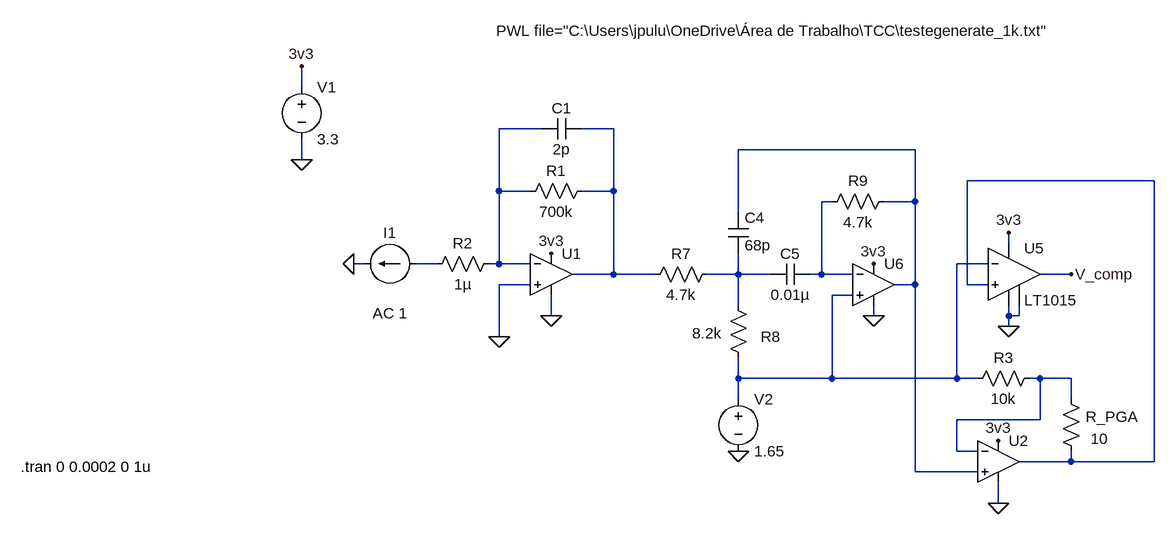
[diagram p0: schematic circuitBackup.asc]
circuitBackup.asc, the LTspice schematic file:
Version 4.1
SHEET 1 1912 1068
WIRE -368 -112 -368 -144
WIRE 0 -48 -64 -48
WIRE 112 -48 64 -48
WIRE 576 -16 304 -16
WIRE -368 0 -368 -32
WIRE 944 32 656 32
WIRE -64 48 -64 -48
WIRE -16 48 -64 48
WIRE 112 48 112 -48
WIRE 112 48 64 48
WIRE 448 64 432 64
WIRE 576 64 576 -16
WIRE 576 64 528 64
WIRE 304 80 304 -16
WIRE 720 128 720 112
WIRE -272 160 -288 160
WIRE -160 160 -192 160
WIRE -64 160 -64 48
WIRE -64 160 -80 160
WIRE -16 160 -64 160
WIRE 688 160 640 160
WIRE 112 176 112 48
WIRE 112 176 48 176
WIRE 176 176 112 176
WIRE 304 176 304 144
WIRE 304 176 256 176
WIRE 352 176 304 176
WIRE 432 176 432 64
WIRE 432 176 416 176
WIRE 480 176 432 176
WIRE 816 176 768 176
WIRE -16 192 -64 192
WIRE 576 192 576 64
WIRE 576 192 544 192
WIRE 656 192 656 32
WIRE 688 192 656 192
WIRE 480 208 448 208
WIRE 304 224 304 176
WIRE 16 240 16 208
WIRE 512 240 512 224
WIRE 720 240 720 224
WIRE 736 240 736 224
WIRE 736 240 720 240
WIRE 720 256 720 240
WIRE -64 272 -64 192
WIRE 304 336 304 304
WIRE 448 336 448 208
WIRE 448 336 304 336
WIRE 640 336 640 160
WIRE 640 336 448 336
WIRE 672 336 640 336
WIRE 768 336 752 336
WIRE 816 336 768 336
WIRE 304 368 304 336
WIRE 816 368 816 336
WIRE 768 400 768 336
WIRE 768 400 640 400
WIRE 640 448 640 400
WIRE 672 448 640 448
WIRE 816 464 816 448
WIRE 816 464 736 464
WIRE 944 464 944 32
WIRE 944 464 816 464
WIRE 576 480 576 192
WIRE 672 480 576 480
WIRE 704 528 704 496
FLAG 16 144 3v3
FLAG 16 240 0
FLAG -64 272 0
FLAG -288 160 0
FLAG 816 176 V_comp
FLAG 720 112 3v3
FLAG 720 256 0
FLAG 512 160 3v3
FLAG 512 240 0
FLAG 304 448 0
FLAG -368 0 0
FLAG -368 -144 3v3
FLAG 704 528 0
FLAG 704 432 3v3
SYMBOL res 80 32 R90
WINDOW 0 0 56 VBottom 2
WINDOW 3 32 56 VTop 2
SYMATTR InstName R1
SYMATTR Value 700k
SYMBOL cap 64 -64 R90
WINDOW 0 0 32 VBottom 2
WINDOW 3 32 32 VTop 2
SYMATTR InstName C1
SYMATTR Value 2p
SYMBOL res -64 144 R90
WINDOW 0 0 56 VBottom 2
WINDOW 3 32 56 VTop 2
SYMATTR InstName R2
SYMATTR Value 1µ
SYMBOL current -192 160 R90
WINDOW 0 -32 40 VBottom 2
WINDOW 3 -374 -552 VTop 2
WINDOW 123 60 40 VTop 2
WINDOW 39 0 0 Left 0
SYMATTR InstName I1
SYMATTR Value PWL file="C:\Users\jpulu\OneDrive\Área de Trabalho\TCC\testegenerate_1k.txt"
SYMATTR Value2 AC 1
SYMBOL OpAmps\\UniversalOpAmp1 16 176 R0
SYMATTR InstName U1
SYMBOL res 272 160 R90
WINDOW 0 0 56 VBottom 2
WINDOW 3 32 56 VTop 2
SYMATTR InstName R7
SYMATTR Value 4.7k
SYMBOL res 320 320 R180
WINDOW 0 -49 48 Left 2
WINDOW 3 41 53 Left 2
SYMATTR InstName R8
SYMATTR Value 8.2k
SYMBOL cap 288 80 R0
WINDOW 0 26 9 Left 2
WINDOW 3 26 51 Left 2
SYMATTR InstName C4
SYMATTR Value 68p
SYMBOL cap 416 160 R90
WINDOW 0 0 32 VBottom 2
WINDOW 3 32 32 VTop 2
SYMATTR InstName C5
SYMATTR Value 0.01µ
SYMBOL res 544 48 R90
WINDOW 0 0 56 VBottom 2
WINDOW 3 32 56 VTop 2
SYMATTR InstName R9
SYMATTR Value 4.7k
SYMBOL OpAmps\\UniversalOpAmp1 512 192 R0
SYMATTR InstName U6
SYMBOL Comparators\\LT1015 720 176 R0
SYMATTR InstName U5
SYMBOL voltage 304 352 R0
WINDOW 123 0 0 Left 0
WINDOW 39 0 0 Left 0
SYMATTR InstName V2
SYMATTR Value 1.65
SYMBOL voltage -368 -128 R0
WINDOW 123 0 0 Left 0
WINDOW 39 0 0 Left 0
SYMATTR InstName V1
SYMATTR Value 3.3
SYMBOL OpAmps\\UniversalOpAmp1 704 464 R0
SYMATTR InstName U2
SYMBOL res 768 320 R90
WINDOW 0 0 56 VBottom 2
WINDOW 3 32 56 VTop 2
SYMATTR InstName R3
SYMATTR Value 10k
SYMBOL res 832 464 R180
WINDOW 0 -87 69 Left 2
WINDOW 3 -41 35 Left 2
SYMATTR InstName R_PGA
SYMATTR Value 10
TEXT -800 472 Left 2 !.tran 0 0.0002 0 1u

The netlist it stands for:
* circuitBackup.asc
R1 N002 N001 700k
C1 N002 N001 2p
R2 N001 N006 1µ
I1 N006 0 PWL file="C:\Users\jpulu\OneDrive\Área de Trabalho\TCC\testegenerate_1k.txt" AC 1
X§U1 0 N001 3v3 0 N002 level1 Avol=1Meg GBW=10Meg Vos=0 En=0 Enk=0 In=0 Ink=0 Rin=500Meg  ; pins In+ In- V+ V- OUT
R7 N008 N002 4.7k
R8 N007 N008 8.2k
C4 N003 N008 68p
C5 N005 N008 0.01µ
R9 N003 N005 4.7k
X§U6 N007 N005 3v3 0 N003 level1 Avol=1Meg GBW=10Meg Vos=0 En=0 Enk=0 In=0 Ink=0 Rin=500Meg  ; pins In+ In- V+ V- OUT
X§U5 N004 N007 3v3 0 V_comp 0 LT1015  ; pins In+ In- VCC ? OUT+ ?
V2 N007 0 1.65
V1 3v3 0 3.3
X§U2 N003 N009 3v3 0 N004 level1 Avol=1Meg GBW=10Meg Vos=0 En=0 Enk=0 In=0 Ink=0 Rin=500Meg  ; pins In+ In- V+ V- OUT
R3 N009 N007 10k
R_PGA N004 N009 10
.tran 0 0.0002 0 1u
.lib UniversalOpAmp1.lib
.lib LT1015.sub
.backanno
.end